# EAGLE design mainboard (EAGLE 7.4.0)
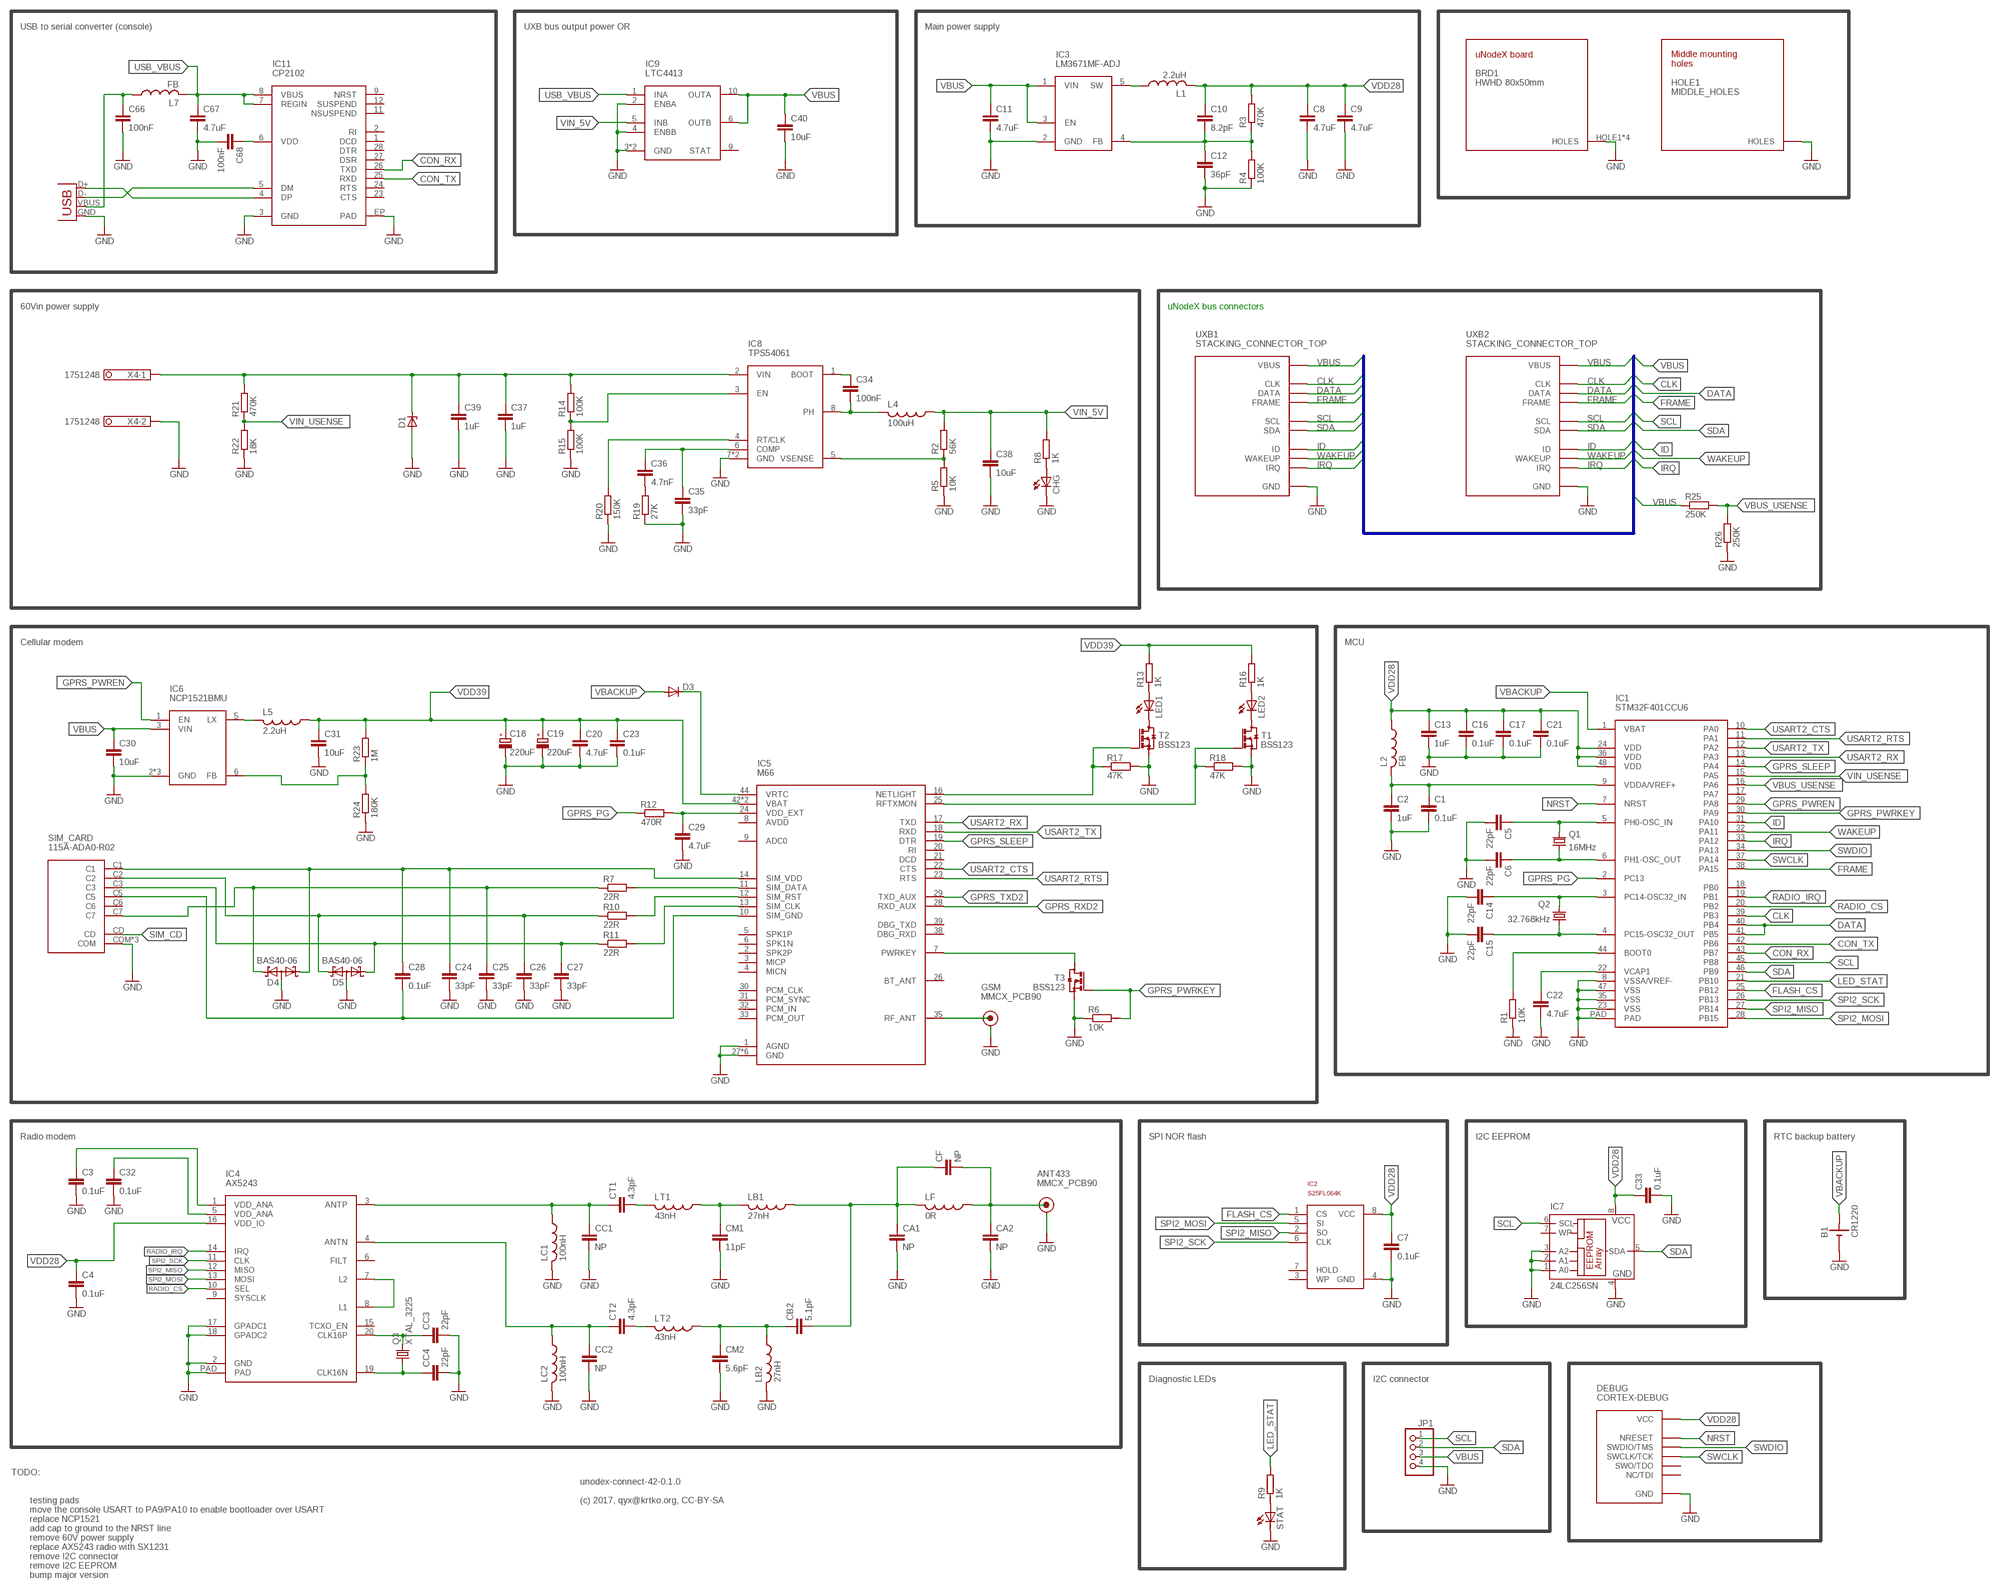
[diagram p0: schematic, sheet 1]

## Parts
ANT433  MMCX_PCB90  [MMCX_PCB_90]
B1  CR1220  CONNFLY_CR1220  [CONNFLY_CR1220]
BRD1  HWHD 80x50mm  BOARD_STACKINGHWHD_SH  [HWHD_SHARP_CORNERS]
C1  0.1uF  C-EUC0603  [C0603]
C2  1uF  C-EUC0603  [C0603]
C3  0.1uF  C-EUC0603  [C0603]
C4  0.1uF  C-EUC0603  [C0603]
C5  22pF  C-EUC0603  [C0603]
C6  22pF  C-EUC0603  [C0603]
C7  0.1uF  C-EUC0603  [C0603]
C8  4.7uF  C-EUC0805  [C0805]
C9  4.7uF  C-EUC0805  [C0805]
C10  8.2pF  C-EUC0603  [C0603]
C11  4.7uF  C-EUC0805  [C0805]
C12  36pF  C-EUC0603  [C0603]
C13  1uF  C-EUC0603  [C0603]
C14  22pF  C-EUC0603  [C0603]
C15  22pF  C-EUC0603  [C0603]
C16  0.1uF  C-EUC0603  [C0603]
C17  0.1uF  C-EUC0603  [C0603]
C18  220uF  CPOL-EUD  [PANASONIC_D]
C19  220uF  CPOL-EUD  [PANASONIC_D]
C20  4.7uF  C-EUC0805  [C0805]
C21  0.1uF  C-EUC0603  [C0603]
C22  4.7uF  C-EUC0603  [C0603]
C23  0.1uF  C-EUC0603  [C0603]
C24  33pF  C-EUC0603  [C0603]
C25  33pF  C-EUC0603  [C0603]
C26  33pF  C-EUC0603  [C0603]
C27  33pF  C-EUC0603  [C0603]
C28  0.1uF  C-EUC0603  [C0603]
C29  4.7uF  C-EUC0805  [C0805]
C30  10uF  C-EUC1206  [C1206]
C31  10uF  C-EUC1206  [C1206]
C32  0.1uF  C-EUC0603  [C0603]
C33  0.1uF  C-EUC0603  [C0603]
C34  100nF  C-EUC0603  [C0603]
C35  33pF  C-EUC0603  [C0603]
C36  4.7nF  C-EUC0603  [C0603]
C37  1uF  C-EUC1206  [C1206]
C38  10uF  C-EUC1206  [C1206]
C39  1uF  C-EUC1206  [C1206]
C40  10uF  C-EUC0805  [C0805]
C66  100nF  C-EUC0603  [C0603]
C67  4.7uF  C-EUC0805  [C0805]
C68  100nF  C-EUC0603  [C0603]
CA1  NP  C-EUC0603  [C0603]
CA2  NP  C-EUC0603  [C0603]
CB2  5.1pF  C-EUC0603  [C0603]
CC1  NP  C-EUC0603  [C0603]
CC2  NP  C-EUC0603  [C0603]
CC3  22pF  C-EUC0603  [C0603]
CC4  22pF  C-EUC0603  [C0603]
CF  NP  C-EUC0603  [C0603]
CHG  LEDCHIPLED_0805  [CHIPLED_0805]
CM1  11pF  C-EUC0603  [C0603]
CM2  5.6pF  C-EUC0603  [C0603]
CT1  4.3pF  C-EUC0603  [C0603]
CT2  4.3pF  C-EUC0603  [C0603]
D1  ZENER-DIODESMB  [SMB]
D3  DIODE-SOD123  [SOD123]
D4  BAS40-06  [SOT23]
D5  BAS40-06  [SOT23]
DEBUG  CORTEX-DEBUG  [CORTEX-DEBUG]
GSM  MMCX_PCB90  [MMCX_PCB_90]
HOLE1  MIDDLE_HOLES  [MIDDLE_HOLES]
IC1  STM32F401CCU6  [UFQFPN48]
IC2  S25FL064K  [SO-08M]
IC3  LM3671MF-ADJ  LM3671MF  [SOT23-5]
IC4  AX5243  [QFN20]
IC5  M66  [M66]
IC6  NCP1521BMU  [UDFN6]
IC7  24LC256SN  [SO-08]
IC8  TPS54061  [WSON8]
IC9  LTC4413  [DFN10]
IC11  CP2102  [QFN28]
JP1  PINHD-1X4  [1X04]
L1  2.2uH  L-USL2825P  [L2825P]
L2  FB  L-USL2012C  [L2012C]
L4  100uH  L-USL5650M  [L5650M]
L5  2.2uH  L-USL2825P  [L2825P]
L7  FB  L-USL2012C  [L2012C]
LB1  27nH  L-USL2012C  [L2012C]
LB2  27nH  L-USL2012C  [L2012C]
LC1  100nH  L-USL2012C  [L2012C]
LC2  100nH  L-USL2012C  [L2012C]
LED1  LEDCHIP-LED0805  [CHIP-LED0805]
LED2  LEDCHIP-LED0805  [CHIP-LED0805]
LF  0R  L-USL2012C  [L2012C]
LT1  43nH  L-USL2012C  [L2012C]
LT2  43nH  L-USL2012C  [L2012C]
Q1  16MHz  XTAL_3225  [XTAL_3225]
Q2  32.768kHz  CRYSTALTC26H  [TC26H]
Q3  XTAL_3225  [XTAL_3225]
R1  10K  R-EU_R0603  [R0603]
R2  56K  R-EU_R0603  [R0603]
R3  470K  R-EU_R0603  [R0603]
R4  100K  R-EU_R0603  [R0603]
R5  10K  R-EU_R0603  [R0603]
R6  10K  R-EU_R0603  [R0603]
R7  22R  R-EU_R0603  [R0603]
R8  1K  R-EU_R0603  [R0603]
R9  1K  R-EU_R0603  [R0603]
R10  22R  R-EU_R0603  [R0603]
R11  22R  R-EU_R0603  [R0603]
R12  470R  R-EU_R0603  [R0603]
R13  1K  R-EU_R0603  [R0603]
R14  100K  R-EU_R0603  [R0603]
R15  100K  R-EU_R0603  [R0603]
R16  1K  R-EU_R0603  [R0603]
R17  47K  R-EU_R0603  [R0603]
R18  47K  R-EU_R0603  [R0603]
R19  27K  R-EU_R0603  [R0603]
R20  150K  R-EU_R0603  [R0603]
R21  470K  R-EU_R0603  [R0603]
R22  18K  R-EU_R0603  [R0603]
R23  1M  R-EU_R0603  [R0603]
R24  180K  R-EU_R0603  [R0603]
R25  250K  R-EU_R0603  [R0603]
R26  250K  R-EU_R0603  [R0603]
SIM_CARD  115A-ADA0-R02  [115A-ADA0-R02]
STAT  LEDCHIPLED_0805  [CHIPLED_0805]
T1  BSS123  [SOT23]
T2  BSS123  [SOT23]
T3  BSS123  [SOT23]
UXB1  STACKING_CONNECTOR_TOP  [HAR-FLEX-TOP-12P]
UXB2  STACKING_CONNECTOR_TOP  [HAR-FLEX-TOP-12P]
X4  1751248  [1751248]
X5  USB-MICROB  [USB-MICROB]

## Nets
ANT: ANT433.C(CENTER) CA2.1 CF.2 LF.1
ANTN: CC2.1 CT2.1 IC4.4(ANTN) LC2.1
ANTP: CC1.1 CT1.1 IC4.3(ANTP) LC1.1
CLK: IC1.39(PB3) UXB1.CLK UXB2.CLK
CON_RX: IC1.43(PB7) IC11.26(TXD)
CON_TX: IC1.42(PB6) IC11.25(RXD)
DATA: IC1.40(PB4) IC1.41(PB5) UXB1.DATA UXB2.DATA
FLASH_CS: IC1.25(PB12) IC2.1(CS)
FRAME: IC1.38(PA15) UXB1.FRAME UXB2.FRAME
GND: ANT433.S1(SHIELD) ANT433.S2(SHIELD) ANT433.S3(SHIELD) ANT433.S4(SHIELD) B1.NEG(-) BRD1.HOLE1(HOLES) BRD1.HOLE2(HOLES) BRD1.HOLE3(HOLES) BRD1.HOLE4(HOLES) C1.2 C2.2 C3.2 C4.2 C5.2 C6.2 C7.2 C8.2 C9.2 C11.2 C12.2 C13.2 C14.2 C15.2 C16.2 C17.2 C18.- C19.- C20.2 C21.2 C22.2 C23.2 C24.2 C25.2 C26.2 C27.2 C29.2 C30.2 C31.2 C32.2 C33.2 C35.2 C37.2 C38.2 C39.2 C40.2 C66.2 C67.2 C68.2 CA1.2 CA2.2 CC1.2 CC2.2 CC3.2 CC4.2 CHG.C CM1.2 CM2.2 D1.A D4.3(AA) D5.3(AA) DEBUG.GND1(GND) DEBUG.GND2(GND) DEBUG.GND_DETECT(GND) GSM.S1(SHIELD) GSM.S2(SHIELD) GSM.S3(SHIELD) GSM.S4(SHIELD) HOLE1.P$1(HOLES) HOLE1.P$2(HOLES) HOLE1.P$3(HOLES) HOLE1.P$4(HOLES) IC1.8(VSSA/VREF-) IC1.23(VSS) IC1.35(VSS) IC1.47(VSS) IC1.PAD IC2.4(GND) IC3.2(GND) IC4.2(GND) IC4.17(GPADC1) IC4.18(GPADC2) IC4.PAD IC5.1(AGND) IC5.27(GND) IC5.34(GND) IC5.36(GND) IC5.37(GND) IC5.40(GND) IC5.41(GND) IC6.2(GND) IC6.4(GND) IC6.PAD(GND) IC7.1(A0) IC7.2(A1) IC7.3(A2) IC7.4(GND) IC8.7(GND) IC8.PAD(GND) IC9.2(ENBA) IC9.3(GND) IC9.4(ENBB) IC9.PAD(GND) IC11.3(GND) IC11.EP(PAD) JP1.4 LB2.2 LC1.2 LC2.2 R1.1 R4.1 R5.1 R6.1 R15.1 R17.2 R18.2 R19.1 R20.1 R22.1 R24.1 R26.1 SIM_CARD.COM SIM_CARD.H1(COM) SIM_CARD.H2(COM) STAT.C T1.2(S) T2.2(S) T3.2(S) UXB1.GND1(GND) UXB1.GND2(GND) UXB1.GND3(GND) UXB1.H1(GND) UXB1.H2(GND) UXB1.H3(GND) UXB1.H4(GND) UXB2.GND1(GND) UXB2.GND2(GND) UXB2.GND3(GND) UXB2.H1(GND) UXB2.H2(GND) UXB2.H3(GND) UXB2.H4(GND) X4.2 X5.GND
GPRS_PG: IC1.2(PC13) R12.1
GPRS_PWREN: IC1.29(PA8) IC6.1(EN)
GPRS_PWRKEY: IC1.30(PA9) R6.2 T3.1(G)
GPRS_RXD2: IC5.28(RXD_AUX)
GPRS_SLEEP: IC1.14(PA4) IC5.19(DTR)
GPRS_TXD2: IC5.29(TXD_AUX)
ID: IC1.31(PA10) UXB1.ID UXB2.ID
IRQ: IC1.33(PA12) UXB1.IRQ UXB2.IRQ
LED_STAT: IC1.21(PB10) R9.2
N$1: CHG.A R8.1
N$2: C1.1 C2.1 IC1.9(VDDA/VREF+) L2.2
N$3: IC3.5(SW) L1.1
N$4: C5.1 IC1.5(PH0-OSC_IN) Q1.3
N$5: C22.1 IC1.22(VCAP1)
N$6: R9.1 STAT.A
N$7: C10.2 C12.1 IC3.4(FB) R3.1 R4.2
N$8: C6.1 IC1.6(PH1-OSC_OUT) Q1.1
N$9: C14.1 IC1.3(PC14-OSC32_IN) Q2.2
N$10: C15.1 IC1.4(PC15-OSC32_OUT) Q2.1
N$11: IC1.44(BOOT0) R1.2
N$12: D3.C IC5.44(VRTC)
N$13: IC5.25(RFTXMON) R18.1 T1.1(G)
N$14: C34.2 IC8.8(PH) L4.2
N$15: C34.1 IC8.1(BOOT)
N$16: IC8.5(VSENSE) R2.1 R5.2
N$19: GSM.C(CENTER) IC5.35(RF_ANT)
N$20: IC5.7(PWRKEY) T3.3(D)
N$27: LED1.C T2.3(D)
N$28: C29.1 IC5.24(VDD_EXT) R12.2
N$29: LED2.C T1.3(D)
N$30: LED1.A R13.1
N$31: LED2.A R16.1
N$32: IC5.16(NETLIGHT) R17.1 T2.1(G)
N$33: IC11.4(DP) X5.D+
N$34: IC11.5(DM) X5.D-
N$35: CA1.1 CB2.2 CF.1 LB1.1 LF.2
N$37: CT1.2 LT1.2
N$38: CM1.1 LB1.2 LT1.1
N$39: CT2.2 LT2.2
N$40: CB2.1 CM2.1 LB2.1 LT2.1
N$41: C3.1 IC4.1(VDD_ANA)
N$42: IC4.7(L2) IC4.8(L1)
N$43: C32.1 IC4.5(VDD_ANA)
N$44: CC3.1 IC4.20(CLK16P) Q3.3
N$45: CC4.1 IC4.19(CLK16N) Q3.1
N$46: C36.2 R19.2
N$48: C35.1 C36.1 IC8.6(COMP)
N$49: IC8.4(RT/CLK) R20.2
N$50: IC6.5(LX) L5.2
N$51: C37.1 C39.1 D1.C IC8.2(VIN) R14.2 R21.2 X4.1
N$52: IC8.3(EN) R14.1 R15.2
N$53: IC6.6(FB) R23.1 R24.2
N$67: C66.1 L7.1 X5.VBUS
N$68: C68.1 IC11.6(VDD)
NRST: DEBUG.NRESET IC1.7(NRST)
RADIO_CS: IC1.20(PB2) IC4.10(SEL)
RADIO_IRQ: IC1.19(PB1) IC4.14(IRQ)
SCL: IC1.45(PB8) IC7.6(SCL) JP1.1 UXB1.SCL UXB2.SCL
SDA: IC1.46(PB9) IC7.5(SDA) JP1.2 UXB1.SDA UXB2.SDA
SIM_CD: SIM_CARD.CD
SIM_CLK: IC5.13(SIM_CLK) R11.2
SIM_CLK_R: C27.1 D5.1(K1) R11.1 SIM_CARD.C3
SIM_DATA: IC5.11(SIM_DATA) R7.2
SIM_DATA_R: C25.1 D4.2(K2) R7.1 SIM_CARD.C7
SIM_GND: C28.2 IC5.10(SIM_GND) SIM_CARD.C5
SIM_RST: IC5.12(SIM_RST) R10.2
SIM_RST_R: C26.1 D5.2(K2) R10.1 SIM_CARD.C2
SIM_VDD: C24.1 C28.1 D4.1(K1) IC5.14(SIM_VDD) SIM_CARD.C1
SPI2_MISO: IC1.27(PB14) IC2.2(SO) IC4.12(MISO)
SPI2_MOSI: IC1.28(PB15) IC2.5(SI) IC4.13(MOSI)
SPI2_SCK: IC1.26(PB13) IC2.6(CLK) IC4.11(CLK)
SWCLK: DEBUG.SWCLK/TCK IC1.37(PA14)
SWDIO: DEBUG.SWDIO/TMS IC1.34(PA13)
USART2_CTS: IC1.10(PA0) IC5.22(CTS)
USART2_RTS: IC1.11(PA1) IC5.23(RTS)
USART2_RX: IC1.13(PA3) IC5.17(TXD)
USART2_TX: IC1.12(PA2) IC5.18(RXD)
USB_VBUS: C67.1 IC9.1(INA) IC11.7(REGIN) IC11.8(VBUS) L7.2
VBACKUP: B1.POS(+) D3.A IC1.1(VBAT)
VBUS: C11.1 C30.1 C40.1 IC3.1(VIN) IC3.3(EN) IC6.3(VIN) IC9.6(OUTB) IC9.10(OUTA) JP1.3 R25.1 UXB1.VBUS UXB2.VBUS
VBUS_USENSE: IC1.16(PA6) R25.2 R26.2
VDD28: C4.1 C7.1 C8.1 C9.1 C10.1 C13.1 C16.1 C17.1 C21.1 C33.1 DEBUG.VCC IC1.24(VDD) IC1.36(VDD) IC1.48(VDD) IC2.8(VCC) IC4.16(VDD_IO) IC7.8(VCC) L1.2 L2.1 R3.2
VDD39: C18.+ C19.+ C20.1 C23.1 C31.1 IC5.42(VBAT) IC5.43(VBAT) L5.1 R13.2 R16.2 R23.2
VIN_5V: C38.1 IC9.5(INB) L4.1 R2.2 R8.2
VIN_USENSE: IC1.15(PA5) R21.1 R22.2
WAKEUP: IC1.32(PA11) UXB1.WAKEUP UXB2.WAKEUP
Unconnected: DEBUG.NC/TDI DEBUG.SWO/TDO IC1.17(PA7) IC1.18(PB0) IC2.3(WP) IC2.7(HOLD) IC4.6(FILT) IC4.9(SYSCLK) IC4.15(TCXO_EN) IC5.2(SPK2P) IC5.3(MICP) IC5.4(MICN) IC5.5(SPK1P) IC5.6(SPK1N) IC5.8(AVDD) IC5.9(ADC0) IC5.20(RI) IC5.21(DCD) IC5.26(BT_ANT) IC5.30(PCM_CLK) IC5.31(PCM_SYNC) IC5.32(PCM_IN) IC5.33(PCM_OUT) IC5.38(DBG_RXD) IC5.39(DBG_TXD) IC7.7(WP) IC9.9(STAT) IC11.1(DCD) IC11.2(RI) IC11.9(NRST) IC11.11(NSUSPEND) IC11.12(SUSPEND) IC11.23(CTS) IC11.24(RTS) IC11.27(DSR) IC11.28(DTR) SIM_CARD.C6

## Buses
VBUS,CLK,DATA,FRAME,SCL,SDA,ID,WAKEUP,IRQ

## Notes on the sheet
- USB to serial converter (console) | UXB bus output power OR | Main power supply
- 60Vin power supply | uNodeX bus connectors
- Cellular modem | MCU
- Radio modem | SPI NOR flash | I2C EEPROM | RTC backup battery
- Diagnostic LEDs | I2C connector
- TODO:
- unodex-connect-42-0.1.0
- testing pads | (c) 2017, qyx@krtko.org, CC-BY-SA
- move the console USART to PA9/PA10 to enable bootloader over USART
- replace NCP1521
- add cap to ground to the NRST line
- remove 60V power supply
- replace AX5243 radio with SX1231
- remove I2C connector
- remove I2C EEPROM
- bump major version

## Library data of the parts
ANT433 GSM = con-coax:MMCX_PCB
B1 = battery-holders:CONNFLY_CR1220
BRD1 = unodex-boards:BOARD_STACKING
C1-C17 C20-C40 C66-C68 CA1 CA2 CB2 CC1-CC4 CF CM1 CM2 CT1 CT2 = rcl:C-EU: CAPACITOR, European symbol
C18 C19 = rcl:CPOL-EU: POLARIZED CAPACITOR, European symbol
CHG LED1 LED2 STAT = led:LED: LED OSRAM: - CHIPLED LG R971, LG N971, LY N971, LG Q971, LY Q971, LO R971, LY R971 LH N974, LH R974 LS Q976, LO Q976, LY Q976 LO Q996 - Hyper CHIPLED LW Q18S LB Q993, LB Q99A, LB R99A - SideLED LS A670, LO A670, LY A670, LG A670, LP A670 LB A673, LV A673, LT A673, LW A673 LH A674 LY A675 LS A676, LA A676, LO A676, LY A676, LW A676 LS A679, LY A679, LG A679 - Hyper Micro SIDELED® LS Y876, LA Y876, LO Y876, LY Y876 LT Y87S - SmartLED LW L88C, LW L88S LB L89C, LB L89S, LG L890 LS L89K, LO L89K, LY L89K LS L896, LA L896, LO L896, LY L896 - TOPLED LS T670, LO T670, LY T670, LG T670, LP T670 LSG T670, LSP T670, LSY T670, LOP T670, LYG T670 LG T671, LOG T671, LSG T671 LB T673, LV T673, LT T673, LW T673 LH T674 LS T676, LA T676, LO T676, LY T676, LB T676, LH T676, LSB T676, LW T676 LB T67C, LV T67C, LT T67C, LS T67K, LO T67K, LY T67K, LW E67C LS E67B, LA E67B, LO E67B, LY E67B, LB E67C, LV E67C, LT E67C LW T67C LS T679, LY T679, LG T679 LS T770, LO T770, LY T770, LG T770, LP T770 LB T773, LV T773, LT T773, LW T773 LH T774 LS E675, LA E675, LY E675, LS T675 LS T776, LA T776, LO T776, LY T776, LB T776 LHGB T686 LT T68C, LB T68C - Hyper Mini TOPLED® LB M676 - Mini TOPLED Santana® LG M470 LS M47K, LO M47K, LY M47K Source: http://www.osram.convergy.de LUXEON: - LUMILED® LXK2-PW12-R00, LXK2-PW12-S00, LXK2-PW14-U00, LXK2-PW14-V00 LXK2-PM12-R00, LXK2-PM12-S00, LXK2-PM14-U00 LXK2-PE12-Q00, LXK2-PE12-R00, LXK2-PE12-S00, LXK2-PE14-T00, LXK2-PE14-U00 LXK2-PB12-K00, LXK2-PB12-L00, LXK2-PB12-M00, LXK2-PB14-N00, LXK2-PB14-P00, LXK2-PB14-Q00 LXK2-PR12-L00, LXK2-PR12-M00, LXK2-PR14-Q00, LXK2-PR14-R00 LXK2-PD12-Q00, LXK2-PD12-R00, LXK2-PD12-S00 LXK2-PH12-R00, LXK2-PH12-S00 LXK2-PL12-P00, LXK2-PL12-Q00, LXK2-PL12-R00 Source: www.luxeon.com KINGBRIGHT: KA-3528ASYC Source: www.kingbright.com
D1 = diode:ZENER-DIODE: Z-Diode
D3 = diode:DIODE-: DIODE
D4 D5 = diode:BAS40-06: Silicon Schottky Diodes General-purpose diode for high-speed switching
DEBUG = debug-connectors:CORTEX-DEBUG
HOLE1 = unodex-boards:MIDDLE_HOLES
IC1 = qyx-misc:STM32F401CCU6
IC2 = qyx-misc:S25FL064K
IC3 = qyx-misc:LM3671
IC4 = radio_transceivers:AX5243
IC5 = gprs_transceivers:M66
IC6 = dc-dc-regulators:NCP1521B
IC7 = microchip:24*: Serial EEPROM I2C; MF: MICROCHIP; MPN: 24LC256-I/SN; OC_FARNELL: 9757996; OC_NEWARK: 27C9144
IC8 = dc-dc-regulators:TPS54061
IC9 = ideal-diodes:LTC4413
IC11 = usb-serial:CP2102
JP1 = pinhead:PINHD-1X4: PIN HEADER
L1 L2 L4 L5 L7 LB1 LB2 LC1 LC2 LF LT1 LT2 = rcl:L-US: INDUCTOR, American symbol
Q1 Q3 = crystals:XTAL_3225
Q2 = crystal:CRYSTAL: CRYSTAL; OC_FARNELL: unknown; OC_NEWARK: unknown
R1-R26 = rcl:R-EU_: RESISTOR, European symbol
SIM_CARD = sim_holders:115A-ADA0-R02
T1-T3 = transistor-small-signal:BSS123: N-CHANNEL MOS FET
UXB1 UXB2 = unodex-boards:STACKING_CONNECTOR_TOP
X4 = con-phoenix-350:1751248: MKDS 1/ 2-3,5 Printklemme Nennstrom: 10 A Bemessungsspannung: 160 V Raster: 3,5 mm Polzahl: 2 Montageart: Löten Anschlussart: Schraubanschluss Anschlussrichtung vom Leiter zur Platine: 0° Source: http://eshop.phoenixcontact.com .. 1751248.pdf; OC_FARNELL: unknown; OC_NEWARK: unknown
X5 = SparkFun:USB: USB Connectors USB-B-PTH is fully proven SKU : PRT-00139 USB-miniB is fully proven SKU : PRT-00587 USB-A-PCB is untested. USB-A-H is throughly reviewed, but untested. Spark Fun Electronics SKU : PRT-00437 USB-B-SMT is throughly reviewed, but untested. Needs silkscreen touching up. USB-A-S has not been used/tested USB-MB-H has not been used/tested

## Net classes
0 default: width 0.2 mm, drill 0.3 mm, clearance 0.2 mm

## Board
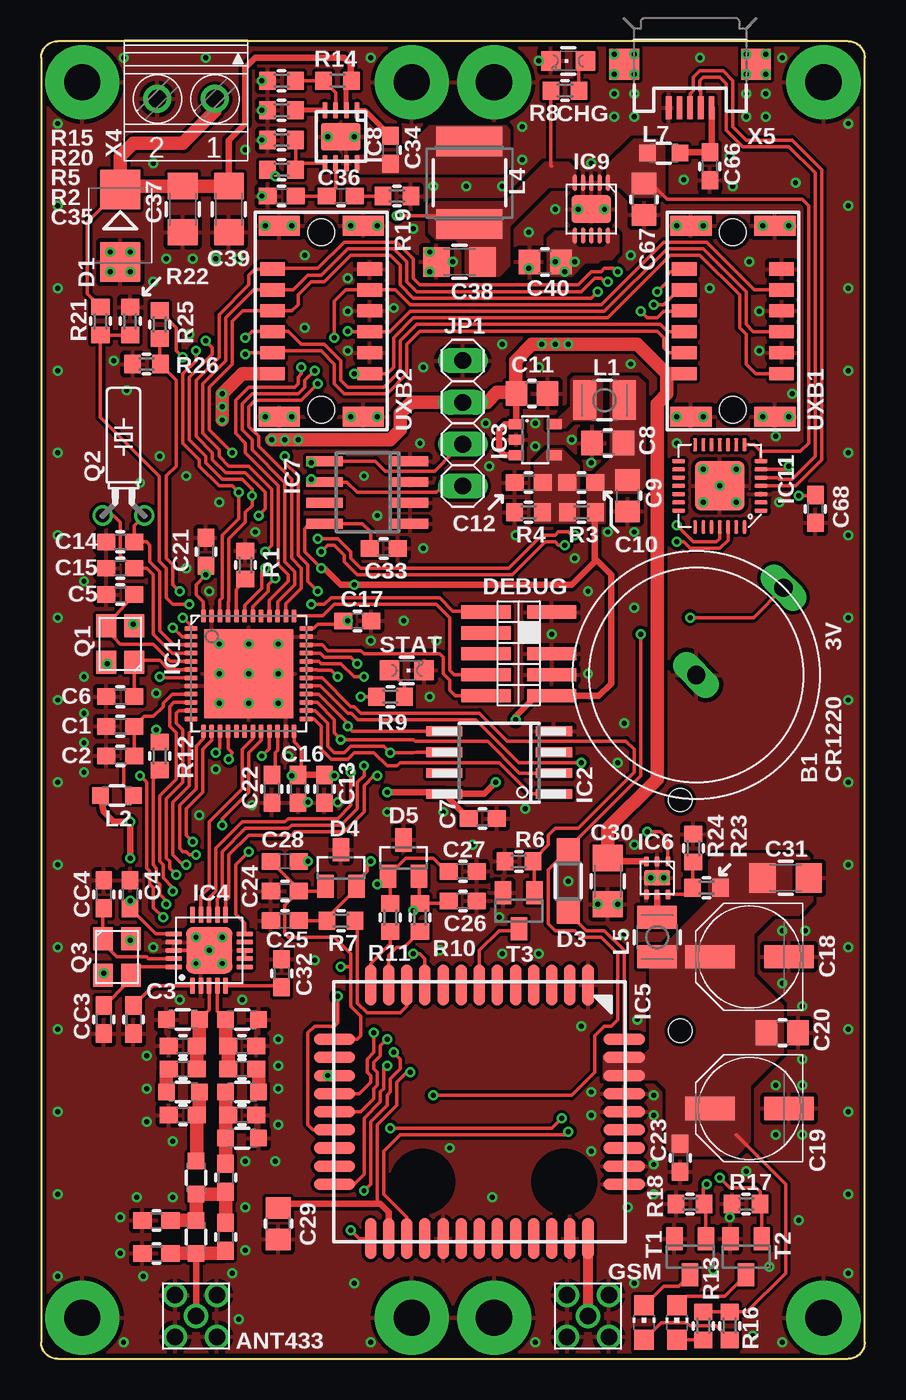
[diagram p1: board, top side]
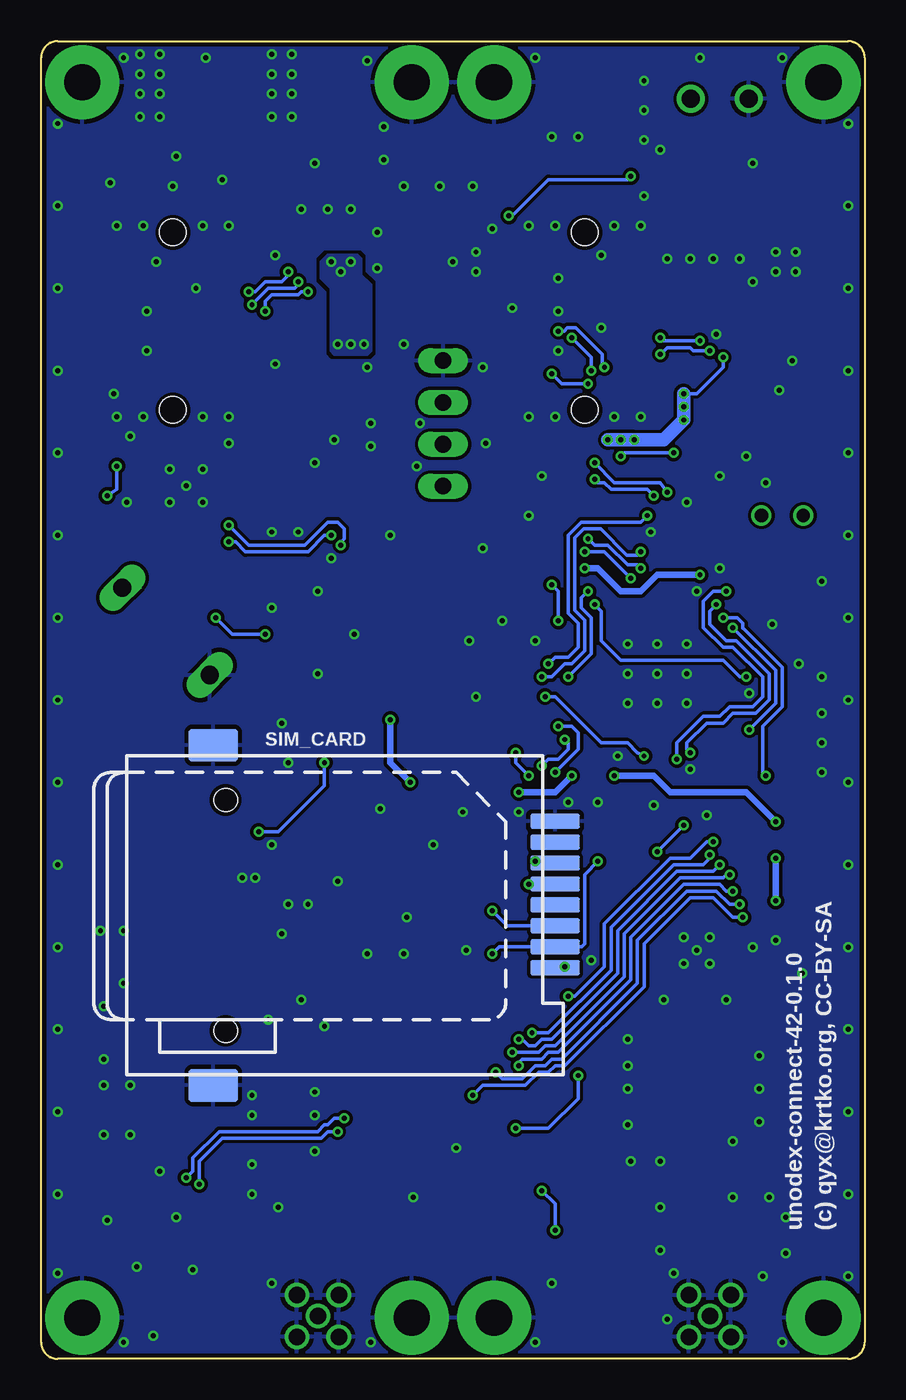
[diagram p2: board, bottom side, seen from below]

Size 50 x 80 mm. Coordinates in mm from the lower left corner, seen from the top.
Copper layers (1*16): Top 0.035mm / dielectric 1.5mm / Bottom 0.035mm
Design rules "seeed": minimum track width 6mil, minimum drill 0.3mm, track to track 6mil, track to pad 6mil, pad to pad 6mil, via to via 6mil, smd to smd 0mil, copper to edge 10mil, drill to drill 10mil, minimum pad ring 6mil, minimum via ring 6mil, stop-mask expansion 2mil, vias tented up to drill 0.5mm, thermal gap 10mil
tRestrict: 9 lines

### Footprints (pad centres in the part's own frame; a part is rotated, then mirrored left to right if it is on the bottom)
MMCX_PCB_90 = drill 1: C 0,0; S1 -1.27,-1.27; S2 1.27,-1.27; S3 1.27,1.27; S4 -1.27,1.27
CONNFLY_CR1220 = drill 1.1 long: NEG 0,0; POS -7.5,0
HWHD_SHARP_CORNERS = drill 2.2 pad 4.5: HOLE1 2.5,2.5; HOLE2 47.5,2.5; HOLE3 47.5,77.5; HOLE4 2.5,77.5
C0603 = smd 1.1 x 1: 1 -0.85,0; 2 0.85,0
C0805 = smd 1.3 x 1.5: 1 -0.95,0; 2 0.95,0
PANASONIC_D = smd 3 x 1.4: + 2.4,0; - -2.4,0
C1206 = smd 1.6 x 1.8: 1 -1.4,0; 2 1.4,0
CHIPLED_0805 = smd 1.2 x 1.2: A 0,-1.05; C 0,1.05
SMB = smd 2.4 x 2.4: A 2.2,0; C -2.2,0
SOD123 = smd 1.4 x 1.4: A 1.9,0; C -1.9,0
SOT23 = smd 1 x 1.4: 1 -0.95,-1.1; 2 0.95,-1.1; 3 0,1.1
CORTEX-DEBUG = smd 0.8 x 3: GND1 -1.27,-2; GND2 0,-2; GND_DETECT 2.54,-2; NC/TDI 1.27,2; NRESET 2.54,2; SWCLK/TCK -1.27,2; SWDIO/TMS -2.54,2; SWO/TDO 0,2; VCC -2.54,-2
MIDDLE_HOLES = drill 2.2 pad 4.5: P$1 -2.5,2.5; P$2 2.5,2.5; P$3 -2.5,77.5; P$4 2.5,77.5
UFQFPN48 = smd 0.8 x 0.3: 1 -3.5,2.75; 2 -3.5,2.25; 3 -3.5,1.75; 4 -3.5,1.25; 5 -3.5,0.75; 6 -3.5,0.25; 7 -3.5,-0.25; 8 -3.5,-0.75; 9 -3.5,-1.25; 10 -3.5,-1.75; 11 -3.5,-2.25; 12 -3.5,-2.75; 25 3.5,-2.75; 26 3.5,-2.25; 27 3.5,-1.75; 28 3.5,-1.25; 29 3.5,-0.75; 30 3.5,-0.25; 31 3.5,0.25; 32 3.5,0.75; 33 3.5,1.25; 34 3.5,1.75; 35 3.5,2.25; 36 3.5,2.75 | smd 0.3 x 0.8: 13 -2.75,-3.5; 14 -2.25,-3.5; 15 -1.75,-3.5; 16 -1.25,-3.5; 17 -0.75,-3.5; 18 -0.25,-3.5; 19 0.25,-3.5; 20 0.75,-3.5; 21 1.25,-3.5; 22 1.75,-3.5; 23 2.25,-3.5; 24 2.75,-3.5; 37 2.75,3.5; 38 2.25,3.5; 39 1.75,3.5; 40 1.25,3.5; 41 0.75,3.5; 42 0.25,3.5; 43 -0.25,3.5; 44 -0.75,3.5; 45 -1.25,3.5; 46 -1.75,3.5; 47 -2.25,3.5; 48 -2.75,3.5 | smd 5.4 x 5.4: PAD 0,0
SO-08M = smd 0.6 x 2.2: 1 -1.905,-3.33; 2 -0.635,-3.33; 3 0.635,-3.33; 4 1.905,-3.33; 5 1.905,3.33; 6 0.635,3.33; 7 -0.635,3.33; 8 -1.905,3.33
SOT23-5 = smd 0.6 x 0.9: 1 -0.95,-1.15; 2 0,-1.15; 3 0.95,-1.15; 4 0.95,1.15; 5 -0.95,1.15
QFN20 = smd 1 x 0.3: 1 -2.15,1; 2 -2.15,0.5; 3 -2.15,0; 4 -2.15,-0.5; 5 -2.15,-1; 11 2.15,-1; 12 2.15,-0.5; 13 2.15,0; 14 2.15,0.5; 15 2.15,1 | smd 0.3 x 1: 6 -1,-2.15; 7 -0.5,-2.15; 8 0,-2.15; 9 0.5,-2.15; 10 1,-2.15; 16 1,2.15; 17 0.5,2.15; 18 0,2.15; 19 -0.5,2.15; 20 -1,2.15 | smd 2.8 x 2.8: PAD 0,0
M66 = smd 2.5 x 0.7: 1 -7.7,6.6; 2 -7.7,5.5; 3 -7.7,4.4; 4 -7.7,3.3; 5 -7.7,2.2; 6 -7.7,1.1; 7 -7.7,0; 8 -7.7,-1.1; 9 -7.7,-2.2; 10 -7.7,-3.3; 11 -7.7,-4.4; 12 -7.7,-5.5; 13 -7.7,-6.6; 23 7.7,-6.6; 24 7.7,-5.5; 25 7.7,-4.4; 26 7.7,-3.3; 27 7.7,-2.2; 28 7.7,-1.1; 29 7.7,0; 30 7.7,1.1; 31 7.7,2.2; 32 7.7,3.3; 33 7.7,4.4; 34 7.7,5.5; 35 7.7,6.6 | smd 0.7 x 2.5: 14 -4.4,-8.8; 15 -3.3,-8.8; 16 -2.2,-8.8; 17 -1.1,-8.8; 18 0,-8.8; 19 1.1,-8.8; 20 2.2,-8.8; 21 3.3,-8.8; 22 4.4,-8.8; 36 4.4,8.8; 37 3.3,8.8; 38 2.2,8.8; 39 1.1,8.8; 40 0,8.8; 41 -1.1,8.8; 42 -2.2,8.8; 43 -3.3,8.8; 44 -4.4,8.8
UDFN6 = smd 0.3 x 0.6: 1 -0.65,-1; 2 0,-1; 3 0.65,-1; 4 0.65,1; 5 0,1; 6 -0.65,1 | smd 1.6 x 0.9: PAD 0,0
SO-08 = smd 0.6 x 2.2: 1 -1.905,-2.6; 2 -0.635,-2.6; 3 0.635,-2.6; 4 1.905,-2.6; 5 1.905,2.6; 6 0.635,2.6; 7 -0.635,2.6; 8 -1.905,2.6
WSON8 = smd 0.3 x 1: 1 0.975,1.6; 2 0.325,1.6; 3 -0.325,1.6; 4 -0.975,1.6; 5 -0.975,-1.6; 6 -0.325,-1.6; 7 0.325,-1.6; 8 0.975,-1.6 | smd 2.4 x 1.65: PAD 0,0
DFN10 = smd 0.25 x 1: 1 -1,-1.6; 2 -0.5,-1.6; 3 0,-1.6; 4 0.5,-1.6; 5 1,-1.6; 6 1,1.6; 7 0.5,1.6; 8 0,1.6; 9 -0.5,1.6; 10 -1,1.6 | smd 2.4 x 1.65: PAD 0,0
QFN28 = smd 0.8 x 0.25: 1 -2.5,1.5; 2 -2.5,1; 3 -2.5,0.5; 4 -2.5,0; 5 -2.5,-0.5; 6 -2.5,-1; 7 -2.5,-1.5; 15 2.5,-1.5; 16 2.5,-1; 17 2.5,-0.5; 18 2.5,0; 19 2.5,0.5; 20 2.5,1; 21 2.5,1.5 | smd 0.25 x 0.8: 8 -1.5,-2.5; 9 -1,-2.5; 10 -0.5,-2.5; 11 0,-2.5; 12 0.5,-2.5; 13 1,-2.5; 14 1.5,-2.5; 22 1.5,2.5; 23 1,2.5; 24 0.5,2.5; 25 0,2.5; 26 -0.5,2.5; 27 -1,2.5; 28 -1.5,2.5 | smd 3 x 3: EP 0,0
1X04 = drill 1.016 long: 1 -3.81,0; 2 -1.27,0; 3 1.27,0; 4 3.81,0
L2825P = smd 1.4 x 2.4: 1 -1.2,0; 2 1.2,0
L2012C = smd 1 x 1: 1 -1,0; 2 1,0
L5650M = smd 1.8 x 4: 1 -2.5,0; 2 2.5,0
CHIP-LED0805 = smd 1.2 x 1.2: A 0,-1.05; C 0,1.05
XTAL_3225 = smd 1.4 x 1.2: 1 -1.1,-0.85; 2 1.1,-0.85; 3 1.1,0.85; 4 -1.1,0.85
TC26H = drill 0.813: 1 -1.27,0; 2 1.27,0
R0603 = smd 1 x 1.1: 1 -0.85,0; 2 0.85,0
115A-ADA0-R02 = smd 0.9 x 3: C1 12.85,26; C2 10.31,26; C3 7.77,26; C5 11.58,26; C6 9.04,26; C7 6.5,26; CD 5.23,26; COM 3.96,26 | smd 2 x 3: H1 -0.65,5.25; H2 20,5.25 | hole 1.4: 2.68,6; 16.68,6
HAR-FLEX-TOP-12P = smd 1.5 x 0.8: CLK -5.05,-15.105; DATA -5.05,-17.645; FRAME -5.05,-20.185; GND1 -5.05,-13.835; GND2 -5.05,-16.375; GND3 -5.05,-18.915; ID -10.95,-16.375; IRQ -10.95,-13.835; SCL -10.95,-17.645; SDA -10.95,-18.915; VBUS -10.95,-20.185; WAKEUP -10.95,-15.105 | smd 2.5 x 1.2: H1 -10.55,-22.8; H2 -5.45,-22.8; H3 -5.45,-11.2; H4 -10.55,-11.2 | hole 1.6: -8,-11.615; -8,-22.385
1751248 = drill 1.1 pad 1.7: 1 -1.75,-0.1; 2 1.75,-0.1
USB-MICROB = smd 0.35 x 1.4: D+ 0,2.65; D- -0.65,2.65; GND 1.3,2.65; ID 0.65,2.65; VBUS -1.3,2.65 | smd 1.8 x 1.9: MT1 -4,0; MT2 4,0

### Placement (x,y rotation side)
ANT433  9.4,2.6 0 top
B1  39.77,41.52 225 top
BRD1  0,0 0 top
C1  4.8,38.4 180 top
C2  4.8,36.6 180 top
C3  5.6,20.6 270 top
C4  5.4,28.2 90 top
C5  4.8,46.4 180 top
C6  4.8,40.2 180 top
C7  26.8,32.8 0 top
C8  34.4,55.6 180 top
C9  35.6,52.4 270 top
C10  32.8,53.2 180 top
C11  29.8,58.6 0 top
C12  29.6,53.2 180 top
C13  17.2,34.6 270 top
C14  4.8,49.6 180 top
C15  4.8,48 180 top
C16  15.6,34.6 270 top
C17  19.2,44.8 0 top
C18  43,24.4 180 top
C19  43,15.2 180 top
C20  45,19.8 0 top
C21  10,49 90 top
C22  14,34.6 270 top
C23  38.8,12.2 270 top
C24  14.8,28.4 180 top
C25  14.8,26.6 180 top
C26  25.6,27.8 0 top
C27  25.6,29.6 0 top
C28  14.8,30.2 0 top
C29  14.4,8.2 270 top
C30  34.4,29 270 top
C31  45.2,29.2 0 top
C32  14.6,23.4 90 top
C33  20.8,49.2 0 top
C34  21.2,73.4 270 top
C35  14.6,70.6 180 top
C36  18.2,70.6 0 top
C37  8.6,69.8 270 top
C38  25.4,66.6 180 top
C39  11.4,69.8 270 top
C40  30.6,66.6 180 top
C66  40.6,72.4 270 top
C67  36.6,70.4 270 top
C68  47,51.6 270 top
CA1  7,8.4 180 top
CA2  7,6.4 180 top
CB2  11.2,11 270 top
CC1  8.6,19 180 top
CC2  12.2,19 0 top
CC3  3.8,20.6 270 top
CC4  3.8,28.2 90 top
CF  11.2,7.4 270 top
CHG  32,78.8 90 top
CM1  8.6,14.8 180 top
CM2  12.2,14.8 0 top
CT1  8.6,17.6 180 top
CT2  12.2,17.6 0 top
D1  4.8,68.8 270 top
D3  32,29 90 top
D4  18.2,29.8 0 top
D5  22,30.4 0 top
DEBUG  29,42.8 90 top
GSM  33.2,2.6 0 top
HOLE1  25,0 0 top
IC1  12.6,41.6 0 top
IC2  27.8,36.2 90 top
IC3  30,55.8 270 top
IC4  10.2,24.8 90 top
IC5  26.6,15 270 top
IC6  37.4,29.2 180 top
IC7  19.8,52.6 90 top
IC8  18.2,74.2 0 top
IC9  33.4,69.8 180 top
IC11  41.2,53 180 top
JP1  25.6,56.8 90 top
L1  34.2,58.2 0 top
L2  4.6,34.2 0 top
L4  26,71.4 90 top
L5  37.4,25.6 90 top
L7  37.8,73.2 180 top
LB1  9.4,11 90 top
LB2  12.2,13.4 0 top
LC1  8.6,20.6 180 top
LC2  12.2,20.6 0 top
LED1  38.6,2.2 0 top
LED2  36.6,2.2 0 top
LF  9.4,7.4 90 top
LT1  8.6,16.2 180 top
LT2  12.2,16.2 0 top
Q1  4.8,43.4 90 top
Q2  5,51.2 0 top
Q3  4.6,24.4 270 top
R1  12.4,48.2 270 top
R2  14.6,72.2 180 top
R3  32.8,51.4 0 top
R4  29.6,51.4 0 top
R5  14.6,74 0 top
R6  29,30.2 0 top
R7  18.2,26.6 0 top
R8  31.8,77 180 top
R9  21.2,40.2 180 top
R10  23,26.8 270 top
R11  21.2,26.8 270 top
R12  7.2,36.6 270 top
R13  40.2,2 90 top
R14  18,77.6 0 top
R15  14.6,77.6 0 top
R16  41.8,2 90 top
R17  42.8,9.4 180 top
R18  39.4,9.4 180 top
R19  21.6,70.6 180 top
R20  14.6,75.8 0 top
R21  3.6,63 90 top
R22  5.4,63 270 top
R23  40.4,28.6 0 top
R24  39.6,31 270 top
R25  7.2,62.8 270 top
R26  6.4,60.4 0 top
SIM_CARD  44.8,36.6 270 bottom
STAT  22.2,41.8 270 top
T1  39.4,6.2 180 top
T2  42.8,6.2 180 top
T3  29,27.2 180 top
UXB1  50,80 0 top
UXB2  25,80 0 top
X4  8.8,76.4 180 top
X5  39.4,78.6 180 top

### Tracks (layer width: path | path; a pad name or v marks a point on that pad's centre or on a via)
ANT
  Top 0.406: ANT433.C LF.1
  Top 0.813: CA2.1 LF.1 11.05,6.4 CF.2
ANTN
  Top 0.2: IC4.4 10.7,21.1 LC2.1
  Top 0.813: LC2.1 11.2,19.15 CC2.1 CT2.1
ANTP
  Top 0.2: IC4.3 10.2,21.2 LC1.1
  Top 0.813: LC1.1 9.6,19.15 CC1.1 CT1.1
CLK  (via drill 0.3)
  Top 0.2: UXB1.CLK 43.3,64.89 40.4,67.8 37.8,67.8 34,64 22.4,64 21.5,64.89 UXB2.CLK 18.5,64.89 17.8,64.2 v17.8,62 | v16.6,60 16,59.4 16,59 15.6,58.6 12.8,58.6 12.2,58 12.2,56.4 12.8,55.8 12.8,55.2 14.8,53.2 14.8,48.4 15.4,47.8 15.4,47 14.35,45.95 IC1.39
  Bottom 0.2: v16.6,60 16.6,60.8 v17.8,62
CON_RX  (via drill 0.3)
  Top 0.2: IC1.43 12.35,45.75 13.4,46.8 13.4,47.8 v13.6,48 | IC11.26 41.7,49.7 41.2,49.2 39.4,49.2 39,49.6 v38.6,49.6 | v16.8,49.8 18,49.8 18.8,49 18.8,48.6 19.4,48 28.4,48 30.4,50 31.2,50 31.4,50.2 32,50.2 32.2,50 v32.4,50
  Bottom 0.2: v13.6,48 13.8,48.2 14.4,48.2 15.6,49.4 16.4,49.4 v16.8,49.8 | v32.4,50 32.8,50 33.8,49 37.6,49 38.2,49.6 v38.6,49.6
CON_TX  (via drill 0.3)
  Top 0.2: IC1.42 12.85,45.65 13.8,46.6 13.8,47 v14.2,47.4 | v38.6,50.6 39.6,49.6 41,49.6 41.2,49.8 IC11.25 | v31.8,49.4 31.4,49.4 31.2,49.6 30.6,49.6 28.6,47.6 19.2,47.6 18.4,48.4 18.4,48.8 17.8,49.4 17.4,49.4 v17,49
  Bottom 0.2: v17,49 15.8,49 v14.2,47.4 | v31.8,49.4 31.8,49.6 31.6,49.8 31.6,50.4 32,50.8 32.6,50.8 34,49.4 37.4,49.4 v38.6,50.6
DATA  (via drill 0.3)
  Top 0.2: UXB1.DATA 43.24,62.35 42.8,62.8 42.8,64.8 40.2,67.4 38,67.4 34.2,63.6 22.4,63.6 21.16,62.35 UXB2.DATA 18.64,62.35 v18.6,62.4 | IC1.41 IC1.40 13.85,46.05 15,47.2 15,47.6 14.4,48.2 14.4,53 12.4,55 12.4,55.6 11.8,56.2 11.8,58.2 12.6,59 15.4,59 15.6,59.2 15.6,59.6 15.8,59.8 v15.8,60.2
  Bottom 0.2: v18.6,62.4 18.25,62.4 18.05,62.6 17.55,62.6 15.95,61 15.95,60.35 v15.8,60.2
FLASH_CS
  Top 0.2: IC2.1 29.7,34.3 27.8,36.2 21.8,36.2 21.6,36 21,36 20.2,36.8 19,36.8 18.6,36.4 17.6,36.4 17,37 17,38.4 16.55,38.85 IC1.25
FRAME  (via drill 0.3)
  Top 0.2: UXB1.FRAME 43.38,59.81 42.8,60.4 42.8,62.2 42.4,62.6 42.4,64.6 40,67 38.2,67 34.4,63.2 22.6,63.2 21.4,62 21.4,60.2 21.02,59.81 UXB2.FRAME 19.93,59.8 v19,59.8 | v16.8,59.2 15.8,58.2 13,58.2 12.6,57.8 12.6,56.6 13.2,56 13.2,55.4 15.2,53.4 15.2,48.6 15.8,48 15.8,46.8 14.85,45.85 IC1.38
  Bottom 0.2: v16.8,59.2 18.4,59.2 v19,59.8
GND  (via drill 0.3)
  Top 0.2: IC4.18 9.4,24.8 v9.4,24
  other vias: 32.4,48.6 34.8,79.2 36,79.2 34.8,78 36,78 42.8,79.2 44,79.2 42.8,78 44,78 49,75 49,70 49,65 49,60 49,55 49,50 49,45 49,40 49,35 49,30 49,25 49,20 49,15 49,10 49,5.2 1,75 1,70 1,65 1,60 1,55 1,50 1,45 1,40 1,35 1,30 1,25 1,20 1,15 1,10 1,5 5,1 12,2.4 19,4.6 20,1 30,1 36,4.6 43.2,1.4 45,1 45,79 40,79 30.2,78.8 34.8,76.8 5,79 10,79 17.4,74.2 20,79 34.8,75.4 45.8,71.4 42,71.2 36,76.8 36,75.4 41.8,73 38.6,68.8 40.2,68.8 43.8,68.8 45.4,68.8 38.6,57.2 40.2,57.2 43.8,57.2 45.4,57.2 13.6,68.8 15.2,68.8 18.8,68.8 20.4,68.8 13.6,57.2 15.2,57.2 18.8,57.2 20.4,57.2 18.6,65.6 21.4,63.8 16,67 18.6,63.6 5.2,58.8 42.2,54 42.2,52 40.2,54 40.2,52 41.2,53 5.6,44.6 4,42.2 2.6,41.4 2.6,39.2 2.6,37.4 2.6,35.6 7,40.4 10.2,46.6 13,50.2 12.8,33.6 16.2,33.8 18,33.8 15,36.6 20,43.6 22,44.8 24,43.6 30,55.4 30,56.8 30.2,60.2 35.8,60.4 32.2,55.8 33.4,54.4 34.4,50.2 36,50.2 28.8,50 2.6,47.2 37.2,16 37.2,14.8 37.2,11.8 37.2,10 35.6,9.2 33.4,16.2 33.4,14.8 33.4,12.6 44.6,13.6 46.2,13.6 44.6,16.6 46.2,16.6 46.2,18.2 46.2,21.4 45,22.8 45,26 46.4,26 9.4,25.6 11,25.6 11,24 6.8,25 5.4,25.4 3.8,23.4 8.4,21.8 6.4,18.4 6.4,16.4 6.4,14.4 8,13.2 8,9.8 5.8,9.8 4.8,8.6 4.8,6.4 6.2,5 11.6,5.2 12.4,6.6 12.4,9.2 12.4,12 14.2,12 14.4,14.2 14.4,16.4 14.4,17.8 14.4,19.4 24.8,12.8 12.2,21.8 10.2,24.8 43.6,63.6 43.6,61.2 43,66.6 18.6,61.2 16,62.6 40.6,65 45.6,58.6 44.6,56 38.6,55.6 44.8,52 20.4,51.2 23.2,60.2 28,61.6 10.8,52 19.6,53.6 23,55.6 27,56.8 27.2,54.2 10.8,43.4 12.6,43.4 14.4,43.4 10.8,41.6 12.6,41.6 10.8,39.8 12.6,39.8 14.4,41.6 14.4,39.8 31,44 33.2,41.6 33.2,46.6 36,45.6 35.4,38.6 23.6,40.2 29.4,33.4 26.2,31.2 24.4,33.2 27.4,9.8 42.8,11.4 30.2,24.6 34.2,21.8 32.8,20.2 40.8,5.4 44.2,5.6 41.8,8.6 46,8.4 19,74.2 13.4,77.6 13.4,75.8 13.4,74 13.4,70.6 29.2,74.8 29.2,72.8 28,71.2 25.8,71.2 23.8,71.2 22.6,68.6 25,66.6 23.6,66 23.6,67.2 42.8,76.8 44,76.8 42.8,75.4 44,75.4 10.6,35.8 9.6,33 29.6,66.2 29.6,68.4 31.2,69.8 32.6,69.8 34.2,69.8 35.8,67 33.4,72.6 39,71.6 4.2,67.2 5.4,67.2 4.2,66 5.4,66 6.8,65.4 4.4,60.6 6,53.2 8.8,48 9,62.2 16.6,24.2 24.2,24.8 27.8,26.8 28,24.6 21,33.2 37,29.2 37.8,29.2 36,31.2 33.8,27.6 35,27.6 35.4,25.8 36.2,20.6 35,36.2 32,29 6.8,72.6 12,66.8 10.6,66.8 9.2,66.8 7.6,66.8 12.4,73.4 7.2,54.8 8.8,53.6 23.2,49.2
  pour Bottom (rank 2): 0,0 50,0 50,80 0,80
  pour Top (rank 2): 0,0 50,0 50,80 0,80
GPRS_PG  (via drill 0.3)
  Top 0.2: v7,38.2 7,37.65 R12.1 | IC1.2 8.55,43.85 v8,44.4
  Bottom 0.2: v7,38.2 5.4,39.8 5.4,41.8 v8,44.4
GPRS_PWREN  (via drill 0.3)
  Top 0.2: IC1.29 16.95,40.85 18.6,39.2 18.83,39.2 19.23,38.8 26.4,38.8 29,36.2 v32.8,36.2 | IC6.1 38.05,31.55 37.6,32 v36.8,32
  Bottom 0.2: v36.8,32 35.6,32 32.8,34.8 v32.8,36.2
GPRS_PWRKEY
  Top 0.2: T3.1 29.95,30.1 R6.2 30,30.35 30,30.4 30.8,31.2 30.8,31.8 31.2,32.2 32.6,32.2 36,35.6 36,37 35.5,37.5 28.3,37.5 26.6,39.2 19.4,39.2 19,39.6 18.8,39.6 17.05,41.35 IC1.30
GPRS_SLEEP  (via drill 0.3)
  Top 0.2: IC1.14 10.35,37.55 9.8,37 9.8,34.4 8.8,33.4 8.8,31.8 v9.2,31.4 | IC5.19 16.5,13.9 16.2,14.2 16.2,19.8 16.6,20.2 17.8,20.2 18,20.4 v18,22
  Bottom 0.2: v9.2,31.4 9.6,31.4 10.6,30.4 11.8,30.4 15.8,26.4 15.8,23.8 17.6,22 v18,22
ID  (via drill 0.3)
  Top 0.2: v36.4,63.6 36.8,63.2 37.4,63.2 37.8,63.6 39.02,63.6 UXB1.ID | v33.8,64.8 33.4,64.4 22.6,64.4 21.8,65.2 21.8,66.4 21.2,67 18.8,67 17.2,65.4 16.4,65.4 15.6,64.6 15.6,64 15.22,63.62 UXB2.ID 12.22,63.62 11.6,63 11.6,60.4 10.2,59 10.2,56.4 v11.6,55 | IC1.31 16.75,41.85 16.8,41.8 17.6,41.8 v18,41.4 | v14.8,54.8 14.8,54.4 15.6,53.6 15.6,48.8 16.2,48.2 16.2,47.2 v16.8,46.6
  Bottom 0.2: v33.8,64.8 34.2,64.8 34.4,64.6 36,64.6 36.4,64.2 v36.4,63.6 | v16.8,46.6 17.2,46.2 17.2,45.6 16.6,45 16.6,42.8 v18,41.4 | v11.6,55 14.6,55 v14.8,54.8
IRQ  (via drill 0.3)
  Top 0.2: UXB1.IRQ 38.88,66 38.2,66 38,65.8 38,65.4 v37.4,64.8 | IC1.33 16.95,42.85 17.2,42.6 18.8,42.6 v19.2,42.2 | v13.2,51.2 13.6,51.6 13.6,52.6 12.4,53.8 11.2,53.8 10.4,54.6 10.4,55 9.4,56 9.4,59.4 10.8,60.8 10.8,63.4 12.6,65.2 12.6,65.8 12.96,66.17 UXB2.IRQ 14.09,66.2 16.8,66.2 18.4,67.8 21.6,67.8 22.6,66.8 22.6,65.6 23,65.2 32.6,65.2 33.4,66 34,66 34.2,66.2 34.8,66.2 v35,66
  Bottom 0.2: v35,66 35,65.8 35.4,65.4 36.4,65.4 37,64.8 v37.4,64.8 | v19.2,42.2 18.8,42.6 18,42.6 17.4,43.2 17.4,44.67 18,45.27 18,50.02 17.21,50.8 13.6,50.8 v13.2,51.2
LED_STAT  (via drill 0.3)
  Top 0.2: IC1.21 13.85,37.05 v13.4,36.6 | v19.4,40.2 R9.2
  Bottom 0.2: v13.4,36.6 13.8,36.8 14.4,37.4 16,37.4 18.8,40.2 v19.4,40.2
N$1
  Top 0.2: R8.1 32.65,78.4 CHG.A
N$2
  Top 0.2: IC1.9 7.95,40.35 7.4,39.8 7.4,39.6 6.8,39 6.25,39 C1.1 C2.1 5.6,36.6 5,36 5,34.8 L2.2
N$3
  pour Top (no thermals): 30.8,57 31.4,57 32.2,57.8 32.2,59.4 32.4,59.6 33.8,59.6 34,59.4 34,57.2 33.8,57 32.2,57 31.8,56.6 30.8,56.6
N$4
  Top 0.2: IC1.5 7.85,42.35 6.8,43.4 4.8,43.4 4.4,43.8 4.4,44.05 Q1.3 C5.1
N$5
  Top 0.2: IC1.22 14.35,36.95 14.2,36.8 14.2,35.95 C22.1 14,35.75
N$6
  Top 0.2: R9.1 22.05,40.9 STAT.A
N$7
  pour Top (no thermals): 30.8,55.2 31.6,55.2 32.6,54.2 32.6,50.8 30,50.8 30,54.4
N$8
  Top 0.2: IC1.6 7.75,41.85 7.2,42.4 5.75,42.4 Q1.1 C6.1
N$9
  Top 0.2: IC1.3 8.05,43.35 7.2,44.2 7.2,47.8 6.6,48.4 6.6,49.4 6.4,49.6 C14.1 5.65,50.58 Q2.2
N$10
  Top 0.2: IC1.4 7.95,42.85 6.8,44 6.8,47.6 6.4,48 C15.1 5.6,48 4.8,48.8 4.8,50.8 4.4,51.2 Q2.1
N$11
  Top 0.2: IC1.44 11.85,46.7 R1.2
N$12
  Top 0.2: IC5.44 35.4,24.8 34.2,26 33.1,26 D3.C
N$13  (via drill 0.3)
  Top 0.2: IC5.25 22.2,8.6 20.8,10 20.8,12.6 21.8,13.6 31.8,13.6 v32,13.8 | v40.4,10.6 40.2,10.4 40.2,9.45 R18.1 40.35,9.3 T1.1
  Bottom 0.2: v32,13.8 32.6,13.8 33,13.4 39,13.4 40.4,12 v40.4,10.6
N$14
  pour Top (no thermals): 19.2,73 21.8,73 23.6,74.8 28.2,74.8 28.4,74.6 28.4,72.4 28,72 19.4,72 19.2,72.2
N$15
  Top 0.305: IC8.1 19.65,75.8 C34.1
N$16
  Top 0.2: IC8.5 15.85,72.6 R2.1 R5.2
N$19
  Top 0.61: GSM.C IC5.35
N$20
  Top 0.2: IC5.7 26.6,24.8 27.8,26 28.9,26 T3.3
N$27
  Top 0.2: LED1.C 38.65,3.25 39.2,3.8 41.5,3.8 T2.3
N$28  (via drill 0.3)
  Top 0.2: R12.2 7.2,35.6 6.8,35.2 6.8,30 7,29.8 7,29 7.2,28.8 7.2,28.2 7.6,27.8 v7.6,27.6 | 20.4,9.4 20.4,14.2 21.6,15.4 21.6,16.8 22.2,17.4 v22.4,17.4
  Top 0.406: IC5.24 21.1,8.9 20.6,9.4 20.4,9.4 14.65,9.4 C29.1
  Bottom 0.2: v22.4,17.4 22,17 20.8,17 20,17.8 19.4,17.8 19,18.2 18.4,18.2 13.8,22.8 13.8,25.4 10.8,28.4 9,28.4 8.2,27.6 v7.6,27.6
N$29
  Top 0.2: LED2.C 36.65,3.25 37.8,4.4 38.7,4.4 T1.3
N$30
  Top 0.2: LED1.A R13.1
N$31
  Top 0.2: R16.1 41.8,1.2 41,2 39.4,2 39.2,2.2 37.65,2.2 LED2.A
N$32  (via drill 0.3)
  Top 0.2: v21.2,14 31,14 v31.6,14.6 | v41.2,11 41.8,10.4 43.4,10.4 43.65,10.15 R17.1 43.75,9.3 T2.1 | IC5.16 v17.4,17.2
  Bottom 0.2: v21.2,14 19.2,14 17.4,15.8 v17.4,17.2 | v31.6,14.6 32.2,14.6 32.6,14.2 32.8,14.2 33.2,13.8 39.2,13.8 40.8,12.2 40.8,11.4 v41.2,11
N$33
  Top 0.2: X5.D+ 39.4,76.8 39.6,77 39.6,77.8 40,78.2 41.4,78.2 42,77.6 42,74.8 42.8,74 45.6,74 47.4,72.2 47.4,54.6 45.8,53 IC11.4
N$34
  Top 0.2: X5.D- 40.05,76.95 40,77 40,77.6 40.2,77.8 41.2,77.8 41.6,77.4 41.6,74.6 42.6,73.6 45.4,73.6 47,72 47,54.8 45.6,53.4 44.8,53.4 44.7,53.5 IC11.5
N$35
  Top 0.813: CF.1 CB2.2 11.05,10 LB1.1 LF.2 CA1.1
N$37
  Top 0.813: LT1.2 7.6,17.45 CT1.2
N$38
  Top 0.813: LT1.1 9.6,14.95 CM1.1 9.45,12.05 LB1.2
N$39
  Top 0.813: LT2.2 13.2,17.45 CT2.2
N$40
  Top 0.813: LT2.1 11.2,14.95 CM2.1 11.2,14.65 LB2.1 CB2.1
N$41
  Top 0.2: IC4.1 6.8,22.65 C3.1
N$42
  Top 0.2: IC4.8 IC4.7
N$43
  Top 0.2: IC4.5 14.5,22.65 C32.1
N$44
  Top 0.2: IC4.20 5.95,23.8 Q3.3 5.2,23.05 5.2,22.8 3.85,21.45 CC3.1
N$45
  Top 0.2: IC4.19 6.5,24.3 6.4,24.4 4.6,24.4 4.2,24.8 4.2,25.05 Q3.1 3.75,27.3 CC4.1
N$46
  Top 0.2: C36.2 R19.2
N$48
  Top 0.2: IC8.6 17.88,71.12 C36.1 C35.1
N$49
  Top 0.305: IC8.4 R20.2
N$50
  Top 0.406: IC6.5 L5.2
N$51
  Top 0.2: D1.C 2.8,69 2.8,64.65 R21.2
  Top 0.305: IC8.2 18.52,77.28 R14.2
  Top 0.406: C39.1 11.4,74 12.4,75 12.4,78.4 13,79 18.4,79 18.8,78.6 18.8,77.65 R14.2
  Top 0.813: X4.1 10.55,75.75 8.6,73.8 5.6,73.8 4.8,73 D1.C 5,71.2 C37.1 C39.1
N$52
  Top 0.2: IC8.3 17.88,76.88 R14.1 R15.2
N$53
  Top 0.2: IC6.6 39.15,28.2 R23.1 39.55,30.1 R24.2
N$67
  Top 0.406: X5.VBUS 40.7,73.35 C66.1 38.85,73.25 L7.1
N$68  (via drill 0.3)
  Top 0.2: IC11.6 45.2,54 v45.4,54.2 | v46,52.4 46.95,52.4 C68.1
  Bottom 0.2: v45.4,54.2 45.4,52.8 v46,52.4
NRST  (via drill 0.3)
  Top 0.2: IC1.7 7.05,41.35 v7.2,41.4 | v16.4,45.8 17.2,45.8 17.6,46.2 24.2,46.2 25,45.4 26.94,45.4 DEBUG.NRESET
  Bottom 0.2: v7.2,41.4 7.6,41.4 8.6,42.4 14.8,42.4 16,43.6 16,45.4 v16.4,45.8
RADIO_CS  (via drill 0.3)
  Top 0.2: IC1.20 13.35,37.55 12.6,36.8 12.6,34.4 11,32.8 v11,32.4 | IC4.10 12.35,26.45 11.8,27 11.8,30 v12.6,30.8
  Bottom 0.2: v11,32.4 v12.6,30.8
RADIO_IRQ
  Top 0.2: IC1.19 12.85,37.65 12.2,37 12.2,34.6 10.2,32.6 10.2,28.6 9.7,28.1 IC4.14
SCL  (via drill 0.3)
  Top 0.2: 14.1,62.4 UXB2.SCL | UXB1.SCL 38.05,62.35 37.6,62.8 22.8,62.8 21.8,61.8 21.8,60 20.8,59 18.6,59 18.2,59.4 18.2,60.6 17.2,61.6 15.8,61.6 15,62.4 14.1,62.4 | IC1.45 11.35,45.95 11.4,46 11.4,49.8 12.4,50.8 12.4,51.4 12.8,51.8 v12.8,52.4 12.8,52.8 12.2,53.4 11,53.4 10,54.4 10,54.8 9,55.8 9,59.6 10.4,61 10.4,61.4 v10,61.8 | 14.1,62.4 12.8,62.4 v12.4,62 | v16.4,53.4 17.04,53.4 IC7.6 18.57,53.23 19.2,52.6 24,52.6 24.2,52.8 25.41,52.8 JP1.1
  Bottom 0.2: v12.8,52.4 13.2,52.8 15.4,52.8 15.8,53.2 16.2,53.2 v16.4,53.4 | v10,61.8 12.2,61.8 v12.4,62
SDA  (via drill 0.3)
  Top 0.2: UXB1.SDA 38.12,61.09 37.8,61.4 37.8,62 37.4,62.4 23,62.4 22.2,61.6 22.2,59.8 21,58.6 18.4,58.6 17.8,59.2 17.8,60.4 17,61.2 14.16,61.2 UXB2.SDA 12.48,61.09 v12.4,61 | IC1.46 10.85,46.05 11,46.2 11,50 12,51 v12,52.6 11.6,53 10.8,53 9.6,54.2 9.6,54.6 8.6,55.6 8.6,59.8 9.4,60.6 v9.4,61.2 | v16.4,54.4 17.09,54.4 IC7.5 20.3,54.51 20.9,53.9 23.9,53.9 25,55 25.07,55 JP1.2
  Bottom 0.2: v12,52.6 12.4,53.2 15.2,53.2 v16.4,54.4 | v9.4,61.2 9.75,61.2 10.4,61.2 10.6,61.4 12,61.4 v12.4,61
SIM_CLK
  Top 0.2: IC5.13 20,24 21.2,25.2 R11.2
SIM_CLK_R  (via drill 0.3)
  Top 0.2: v20.4,28.8 20.55,28.8 D5.1 | C27.1 24.6,29.6 23.8,30.4 22.15,30.4 D5.1 | R11.1 21.2,29.15 D5.1
  Bottom 0.2: SIM_CARD.C3 20.37,28.83 v20.4,28.8
SIM_DATA
  Top 0.2: IC5.11 22.2,21.4 21.8,21 19.8,21 19.2,21.6 19.2,26.45 R7.2
SIM_DATA_R  (via drill 0.3)
  Top 0.2: C25.1 R7.1 17.35,26.75 18.8,28.2 18.8,28.35 D4.2 19.15,28.95 19.8,29.6 19.8,30 v20,30.2
  Bottom 0.2: v20,30.2 18.9,30.2 SIM_CARD.C7
SIM_GND  (via drill 0.3)
  Top 0.2: IC5.10 23.3,24.3 23,24.6 v22.6,24.6 | v16.2,30.2 C28.2
  Bottom 0.2: v22.6,24.6 22.18,25.02 SIM_CARD.C5 17.18,25.02 17,25.2 17,29.4 v16.2,30.2
SIM_RST
  Top 0.2: IC5.12 21.1,24.5 21.6,25 22.05,25 R10.2
SIM_RST_R  (via drill 0.3)
  Top 0.2: D5.2 22.95,27.7 | 22.95,27.7 R10.1 24.6,27.65 C26.1 | 22.95,27.7 22.95,27.55 v22.6,27.2
  Bottom 0.2: SIM_CARD.C2 21.69,26.29 v22.6,27.2
SIM_VDD  (via drill 0.3)
  Top 0.2: C24.1 17.15,28.4 D4.1 | C24.1 14.8,27.55 14.8,25.8 15,25.6 17.8,25.6 18.8,24.6 18.8,23.8 | C24.1 15.65,28.5 C28.1 | IC5.14 19.2,19.4 19.4,19.6 19.4,20.8 18.8,21.4 18.8,23.8 | v18.2,23.8 18.8,23.8
  Bottom 0.2: SIM_CARD.C1 18.25,23.75 v18.2,23.8
SPI2_MISO  (via drill 0.3)
  Top 0.2: IC2.2 29.04,35.56 27.1,37.5 22.7,37.5 22.6,37.6 v18.2,37.6 17.8,38 17.8,38.8 16.75,39.85 IC1.27 | IC4.12 10.7,27.9 11,28.2 11,30.8 12.4,32.2 15,32.2 15.2,32.4 18.2,32.4 19.2,33.4 19.2,35 19.6,35.4 v19.6,36
  Bottom 0.2: 18.2,37.4 v18.2,37.6 18,37.4 18,37 18.6,36.4 19.2,36.4 v19.6,36
SPI2_MOSI  (via drill 0.3)
  Top 0.2: IC4.13 10.2,28 10.6,28.4 10.6,31 12.2,32.6 14.8,32.6 15,32.8 18,32.8 18.8,33.6 v18.8,35.6 | IC1.28 16.85,40.35 18.6,38.6 v18.6,38.4 18.89,38.1 IC2.5
  Bottom 0.2: v18.6,38.4 17.8,38.4 17.4,38 17.4,37 v18.8,35.6
SPI2_SCK  (via drill 0.3)
  Top 0.2: IC4.11 11.2,27.8 11.4,28 11.4,30.6 12.6,31.8 15.2,31.8 15.4,32 18.4,32 19.6,33.2 19.6,34.8 20.2,35.4 v20.4,35.4 | IC1.26 16.65,39.35 17.4,38.6 17.4,37.2 17.8,36.8 18.4,36.8 18.8,37.2 20.8,37.2 v21.2,36.8 22.6,36.8 22.77,36.84 IC2.6
  Bottom 0.2: v20.4,35.4 21.2,36.2 v21.2,36.8
SWCLK
  Top 0.2: IC1.37 17.1,45.1 17.8,45.8 24,45.8 24.8,45 24.8,41.8 25.07,41.53 DEBUG.SWCLK/TCK
SWDIO
  Top 0.2: IC1.34 17.05,43.35 17.4,43 19.4,43 19.6,42.8 24.2,42.8 24.4,42.6 24.4,41.6 24.8,41.2 24.8,40.6 25.14,40.26 DEBUG.SWDIO/TMS
USART2_CTS  (via drill 0.3)
  Top 0.2: IC1.10 8.05,39.85 7.8,39.6 7.8,38.4 8.2,38 8.2,35.2 7.2,34.2 7.2,30.2 7.4,30 7.4,29.2 8,28.6 v8,28.4 | IC5.22 19,10.6 19.6,11.2 19.6,14.6 20.6,15.6 20.6,16.2 20.8,16.4 20.8,17.6 v21,17.8
  Bottom 0.2: v21,17.8 21,18 20.8,18.2 19.6,18.2 19.2,18.6 18.6,18.6 14.2,23 14.2,25.6 11,28.8 8.8,28.8 8.4,28.4 v8,28.4
USART2_RTS  (via drill 0.3)
  Top 0.2: IC1.11 8.35,39.35 8.2,39.2 8.2,38.6 8.6,38.2 8.6,35 7.6,34 7.6,30.4 7.8,30.2 7.8,29.8 v8.2,29.4 | IC5.23 19.3,7.3 v18.8,7.8 | v19.6,10.2 20,10.6 20,14.4 21,15.4 21,16 21.2,16.2 21.2,17 21.8,17.6 21.8,18.2 v21.4,18.6
  Bottom 0.2: v18.8,7.8 18.8,9.4 v19.6,10.2 | v8.2,29.4 8.4,29.4 8.6,29.2 11.2,29.2 14.6,25.8 14.6,23.2 18.8,19 19.4,19 19.8,18.6 v21.4,18.6
USART2_RX  (via drill 0.3)
  Top 0.2: IC1.13 9.85,37.65 9.4,37.2 9.4,34.6 8.4,33.6 8.4,31 8.6,30.8 8.8,30.8 9,30.6 v9.4,30.6 | IC5.17 19.3,16.1 20,16.8 20,17.2 19.8,17.4 19.8,18.2 20.2,18.6 v20.2,19.8
  Bottom 0.2: v9.4,30.6 9.4,30.4 9.8,30 11.6,30 15.4,26.2 15.4,23.6 19.2,19.8 v20.2,19.8
USART2_TX  (via drill 0.3)
  Top 0.2: IC1.12 9.1,38.1 9,38 9,34.8 8,33.8 8,30.6 8.6,30 v8.8,30 | IC5.18 19.4,15 20.2,15.8 20.2,16.4 20.4,16.6 20.4,17.4 20.2,17.6 20.2,18 20.6,18.4 20.6,19 v21,19.4 20.8,19.2
  Bottom 0.2: v8.8,30 9.2,29.6 11.4,29.6 15,26 15,23.4 19,19.4 19.6,19.4 20,19 20.4,19 20.8,19.4 v21,19.4
USB_VBUS
  Top 0.2: IC11.8 43.3,55.5 43.7,55.1 | IC11.7 43.7,55.1 | 43.7,55.1 46.1,55.1 46.6,55.6 46.6,70 46.2,70.4 38,70.4 37.2,71.2
  pour Top (no thermals): 34.4,71.2 35.2,71.2 35.8,70.6 37.6,70.6 37.8,70.8 37.8,73.6 37.4,74 36,74 34.4,72.4
VBACKUP  (via drill 0.3)
  Top 0.2: v6,35.4 6.4,35 6.4,29.8 6.6,29.6 6.6,28.8 6.8,28.6 6.8,27.4 v7.4,26.8 | v36.4,44 36.4,35.4 32,31 D3.A 30.8,29.7 30.8,26.4 31.2,26 32.4,26 32.8,25.6 34,25.6 35,24.6 35,20.6 34.6,20.2 34.2,20.2 33.6,19.6 33.6,17.4 32.2,16 v23.8,16 | v39.4,45 43.25,45 B1.POS | IC1.1 9.1,44.5 v8.6,45
  Bottom 0.2: v36.4,44 38.4,44 v39.4,45 | v23.8,16 23.2,16.6 20.6,16.6 19.8,17.4 19.2,17.4 18.8,17.8 18.2,17.8 13.4,22.6 13.4,25.2 10.6,28 9.2,28 8,26.8 v7.4,26.8 | v8.6,45 8.25,45 7.75,45 7.4,44.65 7.4,44.36 7.36,44.36 5,42 5,39.6 6.2,38.4 6.2,35.6 v6,35.4
VBUS  (via drill 0.3)
  Top 0.2: R25.1 7.2,63.6 8.2,62.6 8.2,61.2 v8.6,60.8
  Top 0.406: IC3.3 28.15,54.85 27.8,55.2 27.8,56.4 28.15,56.75 IC3.1 C11.1 | IC6.3 34.6,30.2 C30.1
  Top 0.813: UXB1.VBUS 37.98,59.81 | 37.98,59.81 36.2,61.6 v32,61.6 v31.2,61.6 v30.4,61.6 29.8,61.6 28.8,60.6 28.8,58.65 C11.1 28.78,58.67 27.67,58.67 27.07,58.07 JP1.3 22.47,58.07 21.8,57.4 21.8,56.4 21.2,55.8 v15.6,55.8 v14.8,55.8 v14,55.8 | UXB2.VBUS 12.21,59.81 v11,58.6 v11,57 | 37.98,59.81 37.98,58.59 37.4,58 37.4,35.2 34.4,32.2 34.4,31 34.6,30.8 34.6,30.6 C30.1
  Bottom 0.2: v8.6,60.8 8.6,60.2 10.2,58.6 v11,58.6
  Bottom 0.813: v11,58.6 v11,57.8 v11,57 12.2,55.8 v14,55.8 v15.6,55.8
  other vias: 31.2,66.6 31.8,66 32.4,66.6
  pour Top (no thermals): 31,65.8 32.2,65.8 33,66.6 33.8,66.6 34,66.8 34.6,66.8 35,67.2 35,68.2 34.8,68.4 34.4,68.4 34.4,67.6 34.2,67.4 32.6,67.4 32.4,67.6 32.4,68.4 31.2,68.4 30.8,68 30.8,66
  pour Bottom: 30.8,67 32.6,67 33,66.6 33,65.6 32.4,65 32.4,61.2 32.2,61 30.2,61 30,61.2 30,65.2 30.6,65.8 30.6,66.8
VBUS_USENSE  (via drill 0.3)
  Top 0.2: R25.2 7.2,60.45 R26.2 7.25,60.35 8.2,59.4 8.2,54.2 7.6,53.6 7.6,48.6 8,48.2 8,47 v8.4,46.6 | v11.4,36.4 11.6,36.8 11.35,37.05 IC1.16
  Bottom 0.2: v8.4,46.6 9.2,46.6 9.8,46 9.8,44.4 8.6,43.2 8,43.2 6.2,41.4 6.2,40.2 6.8,39.6 8.2,39.6 8.8,39 9.8,39 11.4,37.4 v11.4,36.4
VDD28  (via drill 0.3)
  Top 0.2: IC4.16 6.95,25.8 C4.1 | IC1.24 15.35,37.45 15.8,37 15.8,35.65 C16.1 | IC1.36 16.55,44.35 16.8,44.6 18.15,44.6 C17.1 v18.6,44.8 | IC1.48 9.85,45.95 9.4,46.4 9.4,47 v10,47.6 | C33.1 20,49.25 20,50.2 19.5,50.7 IC7.8 17.11,50.6 16.2,50.6 16,50.4 16,49 v17,48
  Top 0.406: v15.2,35.4 15.25,35.45 C16.1 C13.1 17.75,35.45 v17.8,35.4 | L2.1 3.8,33.2 4.4,32.6 v5.4,32.6 v5.4,30.4 | v21,34.4 24.4,34.4 24.5,34.3 IC2.8 | IC2.8 25.87,32.88 C7.1 | v17,48 17.2,48 18.2,47 v19,47 32.2,47 33.6,48.4 33.6,48.6 | 33.6,48.6 33.6,51.35 R3.2 | IC2.8 26.89,34.3 v27.6,35 | 33.6,48.6 34.6,47.6 34.6,41 33.86,40.26 DEBUG.VCC 30.06,40.26 28.8,39 v28.8,38.8 | v10,47.6 C21.1 | C4.1 v5.4,27.8
  Bottom 0.2: v18.6,44.8 18.6,46.6 v19,47
  Bottom 0.406: v10,47.6 12.6,47.6 13.6,46.6 14.8,46.6 16.2,48 v17,48 | v5.4,27.8 v5.4,30.4 | v21,34.4 18.8,34.4 v17.8,35.4 | v28.8,38.8 28.8,36.2 v27.6,35 | v5.4,32.6 7.2,34.4 11.8,34.4 12.8,35.4 v15.2,35.4
  pour Top (no thermals): 34.8,59.6 36.2,59.6 36.6,59.2 36.6,53 36.2,52.6 34.6,52.6 34.2,52.2 34.2,50.8 33.2,50.8 33.2,53.6 33.6,53.6 34.6,54.6 34.6,59.4
VDD39
  Top 0.2: R13.2 R16.2 42.85,2.85 45.2,5.2 45.2,10.6 42.2,13.6
  pour Top (no thermals): 34.2,17 37.4,17 38,16.4 38,12.8 38.4,12.4 42.2,12.4 43,13.2 43,16.6 45,18.6 45,21.4 43.2,23.2 43.2,25.8 44.4,27 46,27 46.8,27.8 46.8,30.2 46.4,30.6 41,30.6 40.6,30.2 40.6,27.8 37,24.2 37,18.8 36.6,18.4 34.2,18.4
VIN_5V  (via drill 0.3)
  Top 0.2: v14.2,71.8 14.15,71.8 R2.2 | 26.5,69.4 L4.1 24.9,68.9 24.4,69.4 v21.6,69.4 | R8.2 30.95,72.45 31,72.4
  Bottom 0.2: v21.6,69.4 21.4,69.4 19.2,71.6 14.4,71.6 v14.2,71.8
  pour Top (no thermals): 23.8,70.2 28.2,70.2 30.6,72.6 32,72.6 32.4,72.2 32.4,71.2 30.8,71.2 28.4,68.8 28.4,66.4 27.8,65.8 26,65.8 25.8,66 25.8,67.4 25.2,68 24,68 23.6,68.4 23.6,70
VIN_USENSE  (via drill 0.3)
  Top 0.2: R22.2 R21.1 3.6,57.16 7.18,53.58 7.18,48.42 7.6,48 7.6,46.2 8,45.8 v9,45.8 | 10.8,37 v10.6,36.8 10.85,37.05 IC1.15
  Bottom 0.2: v9,45.8 9.4,45.4 9.4,44.6 8.4,43.6 7.8,43.6 5.8,41.6 5.8,40 6.6,39.2 8,39.2 8.6,38.6 9.6,38.6 10.8,37.4 10.8,37 v10.6,36.8
WAKEUP  (via drill 0.3)
  Top 0.2: v37.2,64 37.8,64 38.4,64.6 38.76,64.6 UXB1.WAKEUP | v34.4,65.4 34.2,65.4 34,65.6 33.6,65.6 32.8,64.8 22.8,64.8 22.2,65.4 22.2,66.6 21.4,67.4 18.6,67.4 17,65.8 16.2,65.8 15.29,64.89 UXB2.WAKEUP 12.89,64.89 11.2,63.2 11.2,60.6 9.8,59.2 9.8,56.2 10.8,55.2 10.8,54.8 11.4,54.2 12.6,54.2 14,52.8 14,49.4 v13.6,49 | IC1.32 16.85,42.35 17,42.2 18.2,42.2 19,41.4 v19.6,41.4
  Bottom 0.2: v34.4,65.4 34.4,65.2 34.6,65 36.2,65 v37.2,64 | v19.6,41.4 19,41.4 18.2,42.2 17.8,42.2 17,43 17,44.83 17.6,45.44 17.6,49.85 17.05,50.4 16.04,50.4 14.43,48.8 13.8,48.8 v13.6,49

### Text on the board
tNames: 3V | CR1220
bNames: (c) qyx@krtko.org, CC-BY-SA | unodex-connect-42-0.1.0
tDocu: LTC4413